# Altium schematic sheet PGE.SchDoc
size A
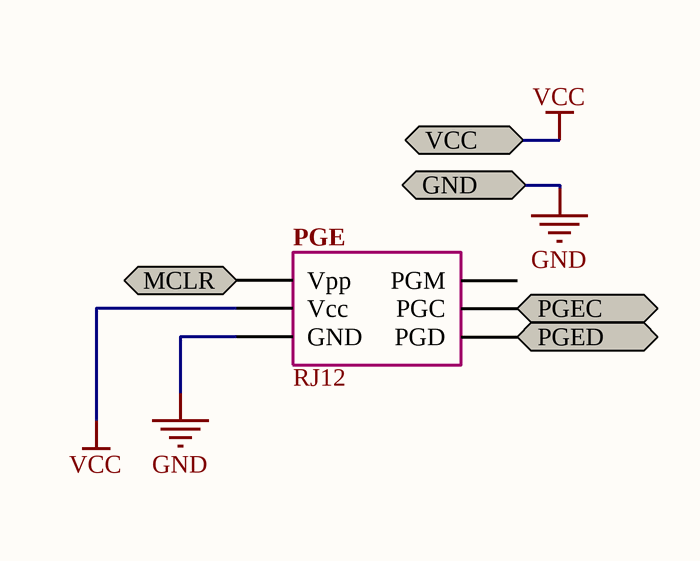
[diagram p0: PGE.SchDoc]

## Parts
PGE  RJ12  [RJ12]

## Ports
GND, MCLR, PGEC, PGED, VCC

## Nets
GND: PGE.4(GND) ; port GND
VCC: PGE.5(Vcc) ; port VCC
MCLR: PGE.6(Vpp) ; port MCLR
PGEC: PGE.2(PGC) ; port PGEC
PGED: PGE.3(PGD) ; port PGED

Not connected (* = marked no-connect by the designer): PGE 1(PGM)

## Library data of the parts
PGE = RJ12: Conector RJ-12; Note: Not recommended for new designs. Consider PIC16C72A or PIC16F72 instead.; buy: farnell:3938359; Published: 8-Jun-2000; LatestRevisionDate: 13-Apr-2006; LatestRevisionNote: IPC-7351 Footprint Added.; DatasheetVersion: DS39016A_1998; PackageVersion: 2005; PackageReference: SOIC300-28; Publisher: Altium Limited; PackageDescription: 28-Pin Small Outline Integrated Circuit 1.27 mm Pitch; Code_JEDEC: MS-013; ComponentLink1Description: Manufacturer Link; ComponentLink1URL: http://www.microchip.com; ComponentLink2Description: Datasheet; ComponentLink2URL: http://ww1.microchip.com/downloads/en/DeviceDoc/39016a.pdf; ComponentLink3Description: Packaging Specification; ComponentLink3URL: http://ww1.microchip.com/downloads/en/PackagingSpec/00049AD.pdf